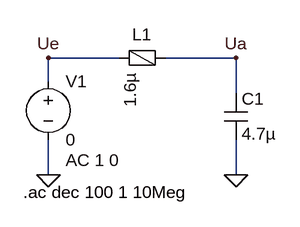
[diagram p0: schematic Analog_Supply_Filter.asc]
Analog_Supply_Filter.asc, the LTspice schematic file:
Version 4
SHEET 1 880 680
WIRE 48 128 -48 128
WIRE 208 128 112 128
WIRE -48 160 -48 128
WIRE 208 176 208 128
WIRE -48 288 -48 240
WIRE 208 288 208 240
FLAG -48 128 Ue
FLAG 208 128 Ua
FLAG -48 288 0
FLAG 208 288 0
SYMBOL cap 192 176 R0
SYMATTR InstName C1
SYMATTR Value 4.7µ
SYMBOL FerriteBead 80 128 R90
WINDOW 0 -16 0 VBottom 2
SYMATTR InstName L1
SYMATTR Value 1.6µ
SYMATTR SpiceLine Rser=.6
SYMBOL voltage -48 144 R0
WINDOW 123 24 124 Left 2
WINDOW 39 0 0 Left 0
SYMATTR InstName V1
SYMATTR Value 0
SYMATTR Value2 AC 1 0
TEXT -82 312 Left 2 !.ac dec 100 1 10Meg

The netlist it stands for:
* Analog_Supply_Filter.asc
C1 Ua 0 4.7µ
L1 Ua Ue 1.6µ Rser=.6
V1 Ue 0 0 AC 1 0
.ac dec 100 1 10Meg
.backanno
.end

* Results of the author's LTspice run, read from the files saved beside the schematic
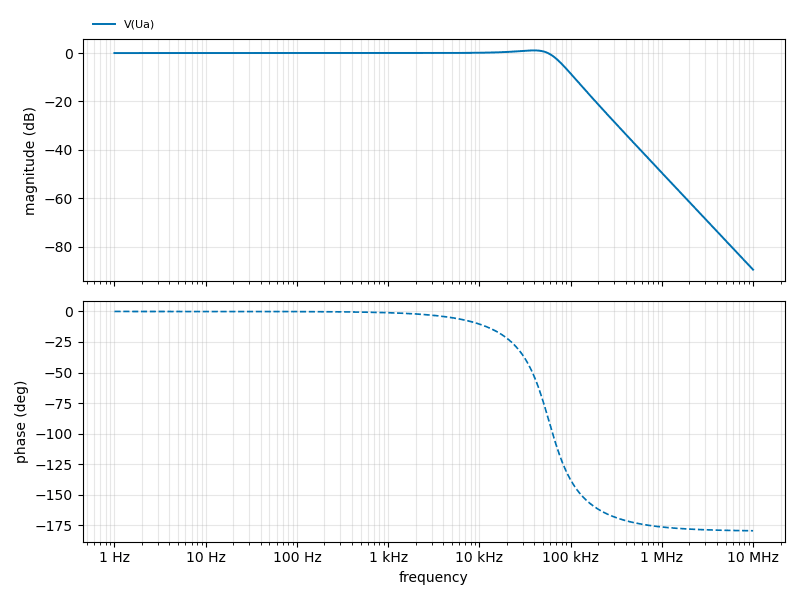
[diagram p1: AC Analysis of Analog_Supply_Filter.asc, plotted from the saved traces]
* AC Analysis, 1 run:
*   V(Ua): 0.00 dB at 1 Hz, -89.45 dB at 10 MHz, peak 1.09 dB at 39.81 kHz, 3 dB below the peak at 67.51 kHz